# EAGLE schematic Element14_AudioServo (EAGLE 6.91.1)
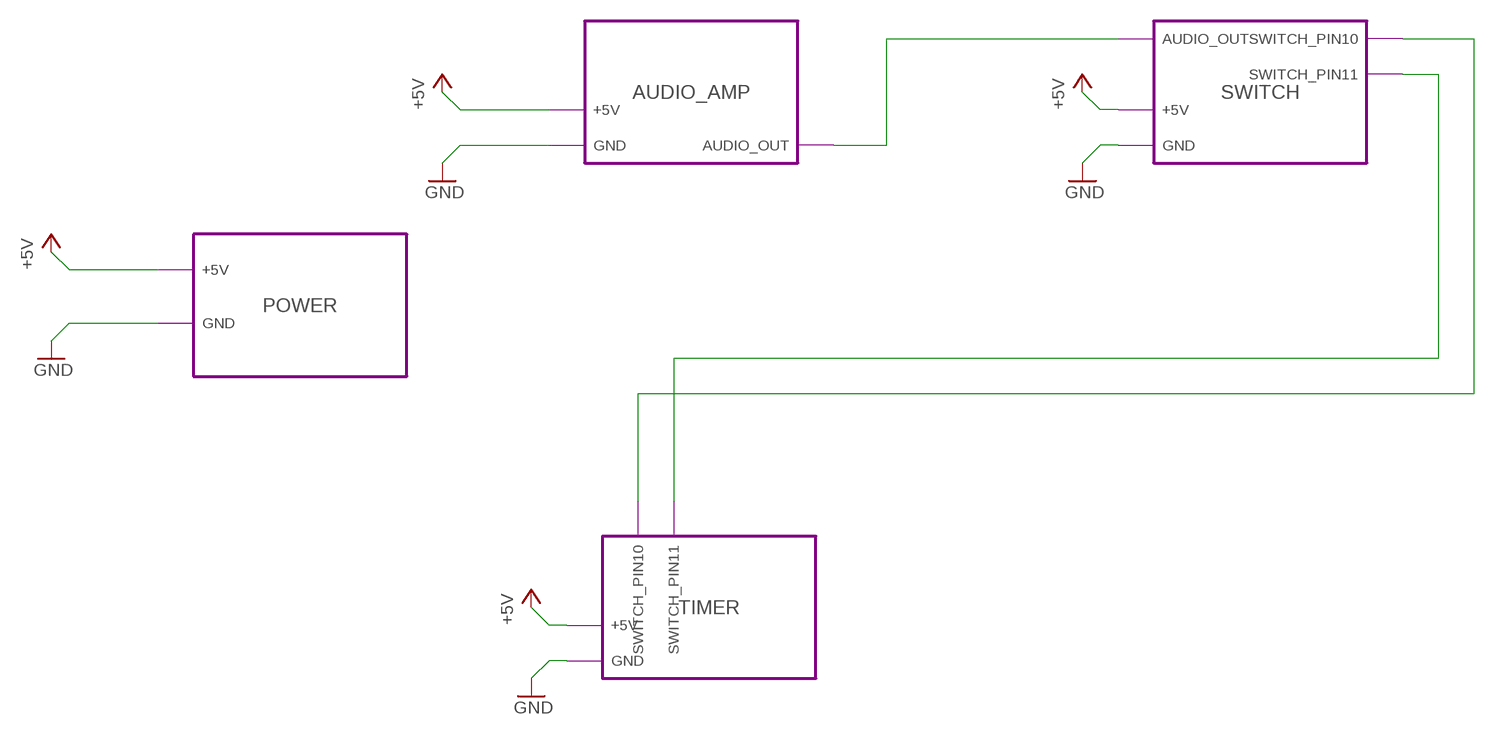
[diagram p0: schematic, sheet 1]

## Module instances
AUDIO_AMP = AUDIO_AMP
TIMER = TIMER
POWER = POWER
SWITCH = SWITCH

## Nets
+5V: port POWER.+5V SWITCH.+5V TIMER.+5V
GND: port AUDIO_AMP.GND POWER.GND SWITCH.GND TIMER.GND
N$1: port AUDIO_AMP.+5V
N$2: port SWITCH.SWITCH_PIN10 TIMER.SWITCH_PIN10
N$3: port AUDIO_AMP.AUDIO_OUT SWITCH.AUDIO_OUT
N$4: port SWITCH.SWITCH_PIN11 TIMER.SWITCH_PIN11

## Library data of the parts

## Module AUDIO_AMP
Ports: GND(io) +5V(io) AUDIO_OUT(io)
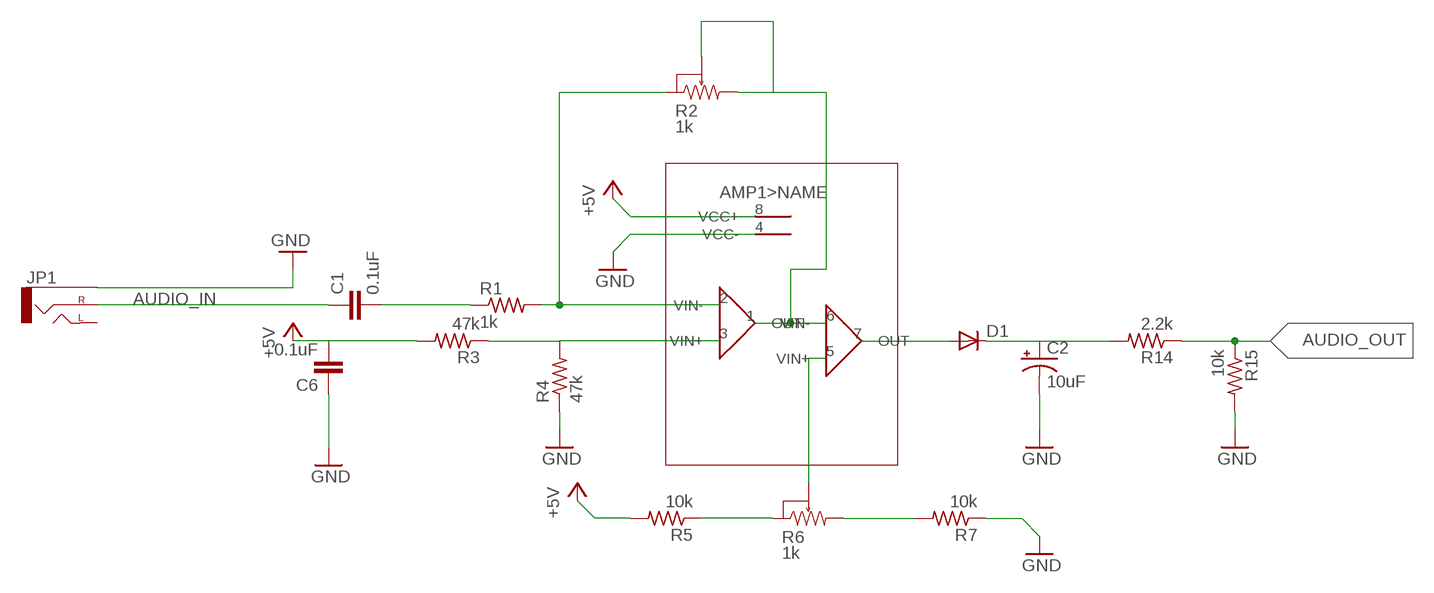
[diagram p1: schematic, module AUDIO_AMP, sheet 1]

### Parts
AMP1  MC1458  [DIP8]
C1  0.1uF  C2,5-3  [C2.5-3]
C2  10uF  CAP_POLPTH2  [CPOL-RADIAL-10UF-25V]
C6  0.1uF  C2,5-3  [C2.5-3]
D1  DIODE-D-5  [D-5]
JP1  AUDIO-JACK2.5MM  [STEREOJACK2.5MM_STEREOJACK2.5MM]
R1  1k  R-US_0204/5  [0204/5]
R2  1k  PVG3_POTENTIOMETER  [PVG3]
R3  47k  R-US_0204/5  [0204/5]
R4  47k  R-US_0204/5  [0204/5]
R5  10k  R-US_0204/5  [0204/5]
R6  1k  PVG3_POTENTIOMETER  [PVG3]
R7  10k  R-US_0204/5  [0204/5]
R14  2.2k  R-US_0204/5  [0204/5]
R15  10k  R-US_0204/5  [0204/5]

### Nets
+5V: AMP1.8(>NAME:VCC+) C6.2 R3.2 R5.2
AUDIO_IN: C1.1 JP1.TIP(RIGHT)
AUDIO_OUT: R14.1 R15.1
GND: AMP1.4(>NAME:VCC-) C2.2(-) C6.1 JP1.RING1(SLEEVE) R4.1 R7.1 R15.2
N$1: AMP1.2(AMP1:VIN-) R1.2 R2.P$1
N$2: C1.2 R1.1
N$4: AMP1.7(AMP2:OUT) D1.A
N$5: AMP1.3(AMP1:VIN+) R3.1 R4.2
N$6: R6.P$2 R7.2
N$7: AMP1.1(AMP1:OUT) AMP1.6(AMP2:VIN-) R2.P$2 R2.P$3
N$8: C2.1(+) D1.C R14.2
N$9: R5.1 R6.P$1
R6: AMP1.5(AMP2:VIN+) R6.P$3
Unconnected: JP1.SHIELD(LEFT)

### Library data of the parts
AMP1 = El14_AudioServo:MC1458; DK: 296-1403-5-ND; PARTNO: MC1458P
C1 C6 = capacitor-wima:C: CAPACITOR naming: grid - package width
C2 = SparkFun-Capacitors:CAP_POL: Capacitor Polarized These are standard SMD and PTH capacitors. Normally 10uF, 47uF, and 100uF in electrolytic and tantalum varieties. Always verify the external diameter of the through hole cap, it varies with capacity, voltage, and manufacturer. The EIA devices should be standard.
D1 = diode:DIODE-: DIODE; PARTNO: 1N914
JP1 = SparkFun-Connectors:AUDIO-JACK: 3.5mm Audio Jack Simple 3.5mm common PCB mount audio jack. SKU: PRT-08032
R1 R3-R5 R7 R14 R15 = resistor:R-US_: RESISTOR, American symbol
R2 R6 = El14_AudioServo:PVG3_POTENTIOMETER

## Module TIMER
Ports: GND(io) +5V(io) SWITCH_PIN10(io) SWITCH_PIN11(io)
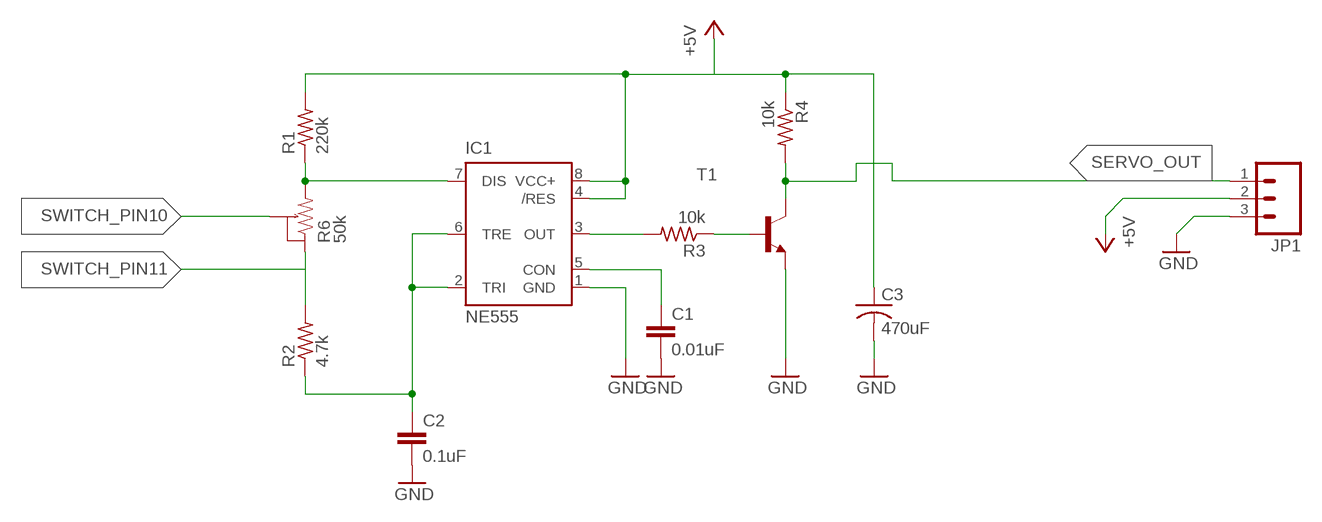
[diagram p2: schematic, module TIMER, sheet 1]

### Parts
C1  0.01uF  C2,5-3  [C2.5-3]
C2  0.1uF  C2,5-3  [C2.5-3]
C3  470uF  C-USC0805  [C0805]
IC1  NE555  [DIL-08]
JP1  M03POLAR  [MOLEX-1X3]
R1  220k  R-US_0204/5  [0204/5]
R2  4.7k  R-US_0204/5  [0204/5]
R3  10k  R-US_0204/5  [0204/5]
R4  10k  R-US_0204/5  [0204/5]
R6  50k  PVG3_POTENTIOMETER  [PVG3]
T1  -NPN-SOT23-EBC  [SOT23-EBC]

### Nets
+5V: C3.1 IC1.4(/RES) IC1.8(VCC+) JP1.2 R1.2 R4.1
GND: C1.2 C2.2 C3.2 IC1.1(GND) JP1.3 T1.E
N$1: C1.1 IC1.5(CON)
N$3: IC1.3(OUT) R3.2
N$4: R3.1 T1.B
N$7: C2.1 IC1.2(TRI) IC1.6(TRE) R2.1
N$9: IC1.7(DIS) R1.1 R6.P$2
SERVO_OUT: JP1.1 R4.2 T1.C
SWITCH_PIN10: R6.P$3
SWITCH_PIN11: R2.2 R6.P$1

### Library data of the parts
C1 C2 = capacitor-wima:C: CAPACITOR naming: grid - package width
C3 = resistor:C-US: CAPACITOR, American symbol
IC1 = st-microelectronics:NE555: General purpose bipolar Timer; MF: Arrow Electronics; MPN: NE555N; OC_FARNELL: 1467742; OC_NEWARK: 89K1486
JP1 = SparkFun-Connectors:M03: Header 3 Standard 3-pin 0.1" header. Use with straight break away headers (SKU : PRT-00116), right angle break away headers (PRT-00553), swiss pins (PRT-00743), machine pins (PRT-00117), and female headers (PRT-00115). Molex polarized connector foot print use with SKU : PRT-08232 with associated crimp pins and housings.
R1-R4 = resistor:R-US_: RESISTOR, American symbol
R6 = El14_AudioServo:PVG3_POTENTIOMETER
T1 = transistor:*-NPN-: NPN Transistror BF959 corrected 2008.03.06

## Module POWER
Ports: GND(io) +5V(io)
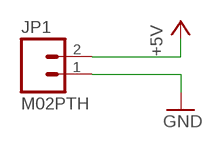
[diagram p3: schematic, module POWER, sheet 1]

### Parts
JP1  M02PTH  [1X02]

### Nets
+5V: JP1.2
GND: JP1.1

### Library data of the parts
JP1 = SparkFun-Connectors:M02: Standard 2-pin 0.1" header. Use with - straight break away headers ( PRT-00116) - right angle break away headers (PRT-00553) - swiss pins (PRT-00743) - machine pins (PRT-00117) - female headers (PRT-00115) Molex polarized connector foot print use with: PRT-08233 with associated crimp pins and housings. 2.54_SCREWTERM for use with PRT-10571. 3.5mm Screw Terminal footprints for PRT-08084 5mm Screw Terminal footprints for use with PRT-08433

## Module SWITCH
Ports: GND(io) +5V(io) AUDIO_OUT(io) SWITCH_PIN10(io) SWITCH_PIN11(io)
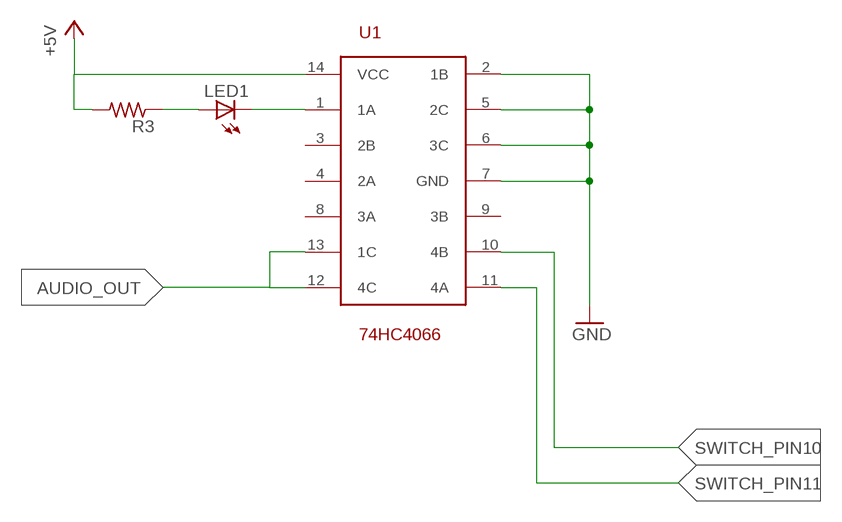
[diagram p4: schematic, module SWITCH, sheet 1]

### Parts
74HC4066  U1  74HC4066  [DIP14]
LED1  LED  [SMARTLED-TTW]
R3  R-US_0204/5  [0204/5]

### Nets
+5V: 74HC4066.14(VCC) R3.2
AUDIO_OUT: 74HC4066.12(4C) 74HC4066.13(1C)
GND: 74HC4066.2(1B) 74HC4066.5(2C) 74HC4066.6(3C) 74HC4066.7(GND)
N$3: 74HC4066.1(1A) LED1.C@1(C)
N$4: LED1.A@1(A) R3.1
SWITCH_PIN10: 74HC4066.10(4B)
SWITCH_PIN11: 74HC4066.11(4A)
Unconnected: 74HC4066.3(2B) 74HC4066.4(2A) 74HC4066.8(3A) 74HC4066.9(3B)

### Library data of the parts
74HC4066 = El14_AudioServo:74HC4066
LED1 = arduino_Uno_Rev3-02-TH:LED: LED OSRAM: - CHIPLED LG R971, LG N971, LY N971, LG Q971, LY Q971, LO R971, LY R971 LH N974, LH R974 LS Q976, LO Q976, LY Q976 LO Q996 - Hyper CHIPLED LW Q18S LB Q993, LB Q99A, LB R99A - SideLED LS A670, LO A670, LY A670, LG A670, LP A670 LB A673, LV A673, LT A673, LW A673 LH A674 LY A675 LS A676, LA A676, LO A676, LY A676, LW A676 LS A679, LY A679, LG A679 - Hyper Micro SIDELED® LS Y876, LA Y876, LO Y876, LY Y876 LT Y87S - SmartLED LW L88C, LW L88S LB L89C, LB L89S, LG L890 LS L89K, LO L89K, LY L89K LS L896, LA L896, LO L896, LY L896 - TOPLED LS T670, LO T670, LY T670, LG T670, LP T670 LSG T670, LSP T670, LSY T670, LOP T670, LYG T670 LG T671, LOG T671, LSG T671 LB T673, LV T673, LT T673, LW T673 LH T674 LS T676, LA T676, LO T676, LY T676, LB T676, LH T676, LSB T676, LW T676 LB T67C, LV T67C, LT T67C, LS T67K, LO T67K, LY T67K, LW E67C LS E67B, LA E67B, LO E67B, LY E67B, LB E67C, LV E67C, LT E67C LW T67C LS T679, LY T679, LG T679 LS T770, LO T770, LY T770, LG T770, LP T770 LB T773, LV T773, LT T773, LW T773 LH T774 LS E675, LA E675, LY E675, LS T675 LS T776, LA T776, LO T776, LY T776, LB T776 LHGB T686 LT T68C, LB T68C - Hyper Mini TOPLED® LB M676 - Mini TOPLED Santana® LG M470 LS M47K, LO M47K, LY M47K Source: http://www.osram.convergy.de LUXEON: - LUMILED® LXK2-PW12-R00, LXK2-PW12-S00, LXK2-PW14-U00, LXK2-PW14-V00 LXK2-PM12-R00, LXK2-PM12-S00, LXK2-PM14-U00 LXK2-PE12-Q00, LXK2-PE12-R00, LXK2-PE12-S00, LXK2-PE14-T00, LXK2-PE14-U00 LXK2-PB12-K00, LXK2-PB12-L00, LXK2-PB12-M00, LXK2-PB14-N00, LXK2-PB14-P00, LXK2-PB14-Q00 LXK2-PR12-L00, LXK2-PR12-M00, LXK2-PR14-Q00, LXK2-PR14-R00 LXK2-PD12-Q00, LXK2-PD12-R00, LXK2-PD12-S00 LXK2-PH12-R00, LXK2-PH12-S00 LXK2-PL12-P00, LXK2-PL12-Q00, LXK2-PL12-R00 Source: www.luxeon.com KINGBRIGHT: KA-3528ASYC Source: www.kingbright.com
R3 = resistor:R-US_: RESISTOR, American symbol

## Net classes
0 default: width 0.254 mm, clearance 0.254 mm
1 power: width 0.61 mm, drill 0.61 mm, clearance 0.254 mm
2 gnd: width 0.305 mm, drill 0.559 mm, clearance 0.254 mm
3 usbvcc: width 0.508 mm, drill 0.61 mm, clearance 0.254 mm
4 aref: width 0.406 mm, drill 0.61 mm, clearance 0.254 mm